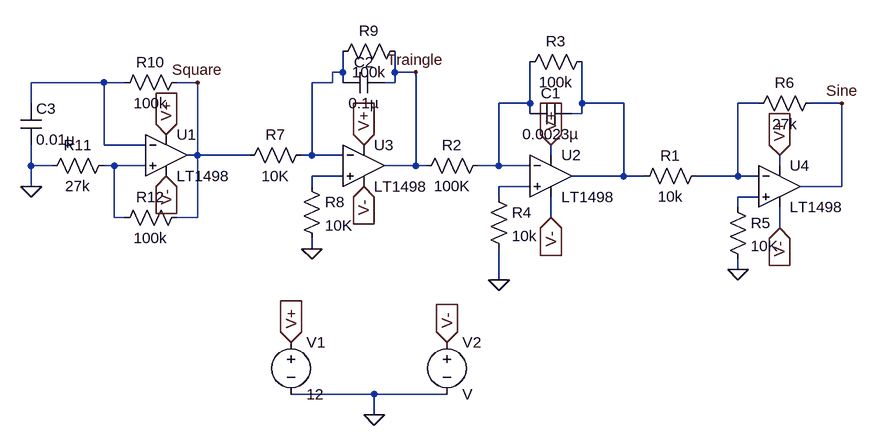
[diagram p0: schematic Draft3.asc]
Draft3.asc, the LTspice schematic file:
Version 4
SHEET 1 956 680
WIRE 144 -32 144 -64
WIRE 144 -32 128 -32
WIRE 224 -32 224 -64
WIRE 256 -32 224 -32
WIRE -224 -16 -336 -16
WIRE -192 -16 -224 -16
WIRE -80 -16 -112 -16
WIRE 128 -16 128 -32
WIRE 128 -16 96 -16
WIRE 144 -16 144 -32
WIRE 224 -16 224 -32
WIRE 224 -16 208 -16
WIRE -336 16 -336 -16
WIRE 432 16 432 -48
WIRE 432 16 384 16
WIRE 512 16 512 -48
WIRE 576 16 512 16
WIRE 784 16 752 16
WIRE 912 16 864 16
WIRE 432 32 432 16
WIRE 512 32 512 16
WIRE 512 32 496 32
WIRE -224 80 -224 -16
WIRE -160 80 -224 80
WIRE -80 96 -80 -16
WIRE -80 96 -96 96
WIRE 0 96 -80 96
WIRE 96 96 96 -16
WIRE 96 96 80 96
WIRE 144 96 96 96
WIRE 464 96 464 80
WIRE -336 112 -336 80
WIRE -304 112 -336 112
WIRE -208 112 -224 112
WIRE -160 112 -208 112
WIRE 256 112 256 -32
WIRE 256 112 208 112
WIRE 272 112 256 112
WIRE 384 112 384 16
WIRE 384 112 352 112
WIRE 432 112 384 112
WIRE 816 112 816 96
WIRE 144 128 96 128
WIRE 576 128 576 16
WIRE 576 128 496 128
WIRE 608 128 576 128
WIRE 752 128 752 16
WIRE 752 128 688 128
WIRE 784 128 752 128
WIRE -336 144 -336 112
WIRE 96 144 96 128
WIRE 432 144 384 144
WIRE 912 144 912 16
WIRE 912 144 848 144
WIRE 384 160 384 144
WIRE 784 160 752 160
WIRE 752 176 752 160
WIRE -208 192 -208 112
WIRE -192 192 -208 192
WIRE -80 192 -80 96
WIRE -80 192 -112 192
WIRE 464 192 464 160
WIRE 816 208 816 176
WIRE 96 240 96 224
WIRE 752 272 752 256
WIRE 384 288 384 240
WIRE 192 464 64 464
WIRE 304 464 192 464
WIRE 192 496 192 464
FLAG 384 288 0
FLAG 752 272 0
FLAG 464 80 V+
IOPIN 464 80 In
FLAG 176 80 V+
IOPIN 176 80 In
FLAG 816 96 V+
IOPIN 816 96 In
FLAG 176 144 V-
IOPIN 176 144 In
FLAG 464 192 V-
IOPIN 464 192 In
FLAG 816 208 V-
IOPIN 816 208 In
FLAG 96 240 0
FLAG -336 144 0
FLAG -128 64 V+
IOPIN -128 64 In
FLAG -128 128 V-
IOPIN -128 128 In
FLAG -80 -16 Square
FLAG 256 -32 Traingle
FLAG 912 16 Sine
FLAG 192 496 0
FLAG 64 384 V+
IOPIN 64 384 In
FLAG 304 384 V-
IOPIN 304 384 In
SYMBOL OpAmps\\LT1498 464 64 R0
SYMATTR InstName U2
SYMBOL OpAmps\\LT1498 176 48 R0
SYMATTR InstName U3
SYMBOL OpAmps\\LT1498 816 80 R0
SYMATTR InstName U4
SYMBOL res 704 112 R90
WINDOW 0 0 56 VBottom 2
WINDOW 3 32 56 VTop 2
SYMATTR InstName R1
SYMATTR Value 10k
SYMBOL res 368 96 R90
WINDOW 0 0 56 VBottom 2
WINDOW 3 32 56 VTop 2
SYMATTR InstName R2
SYMATTR Value 100K
SYMBOL res 528 -64 R90
WINDOW 0 0 56 VBottom 2
WINDOW 3 32 56 VTop 2
SYMATTR InstName R3
SYMATTR Value 100k
SYMBOL cap 496 16 R90
WINDOW 0 0 32 VBottom 2
WINDOW 3 32 32 VTop 2
SYMATTR InstName C1
SYMATTR Value 0.0023µ
SYMBOL res 368 144 R0
SYMATTR InstName R4
SYMATTR Value 10k
SYMBOL res 736 160 R0
SYMATTR InstName R5
SYMATTR Value 10K
SYMBOL res 880 0 R90
WINDOW 0 0 56 VBottom 2
WINDOW 3 32 56 VTop 2
SYMATTR InstName R6
SYMATTR Value 27k
SYMBOL res 96 80 R90
WINDOW 0 0 56 VBottom 2
WINDOW 3 32 56 VTop 2
SYMATTR InstName R7
SYMATTR Value 10K
SYMBOL res 80 128 R0
SYMATTR InstName R8
SYMATTR Value 10K
SYMBOL res 240 -80 R90
WINDOW 0 0 56 VBottom 2
WINDOW 3 32 56 VTop 2
SYMATTR InstName R9
SYMATTR Value 100k
SYMBOL cap 208 -32 R90
WINDOW 0 0 32 VBottom 2
WINDOW 3 32 32 VTop 2
SYMATTR InstName C2
SYMATTR Value 0.1µ
SYMBOL res -96 -32 R90
WINDOW 0 0 56 VBottom 2
WINDOW 3 32 56 VTop 2
SYMATTR InstName R10
SYMATTR Value 100k
SYMBOL res -208 96 R90
WINDOW 0 0 56 VBottom 2
WINDOW 3 32 56 VTop 2
SYMATTR InstName R11
SYMATTR Value 27k
SYMBOL OpAmps\\LT1498 -128 32 R0
SYMATTR InstName U1
SYMBOL cap -352 16 R0
SYMATTR InstName C3
SYMATTR Value 0.01µ
SYMBOL res -96 176 R90
WINDOW 0 0 56 VBottom 2
WINDOW 3 32 56 VTop 2
SYMATTR InstName R12
SYMATTR Value 100k
SYMBOL voltage 64 368 R0
WINDOW 123 0 0 Left 0
WINDOW 39 0 0 Left 0
SYMATTR InstName V1
SYMATTR Value 12
SYMBOL voltage 304 368 R0
SYMATTR InstName V2

The netlist it stands for:
* Draft3.asc
XU2 N008 N003 V+ V- N004 LT1498  ; pins In+ In- V+ V- OUT
XU3 N007 N001 V+ V- Traingle LT1498  ; pins In+ In- V+ V- OUT
XU4 N009 N005 V+ V- Sine LT1498  ; pins In+ In- V+ V- OUT
R1 N005 N004 10k
R2 N003 Traingle 100K
R3 N004 N003 100k
C1 N004 N003 0.0023µ
R4 N008 0 10k
R5 N009 0 10K
R6 Sine N005 27k
R7 N001 Square 10K
R8 N007 0 10K
R9 Traingle N001 100k
C2 Traingle N001 0.1µ
R10 Square N002 100k
R11 N006 0 27k
XU1 N006 N002 V+ V- Square LT1498  ; pins In+ In- V+ V- OUT
C3 N002 0 0.01µ
R12 Square N006 100k
V1 V+ 0 12
V2 V- 0 V
.lib LTC.lib
.backanno
.end